# EAGLE design DisplayController (EAGLE 6.1)

## Sheet 1 of 3: Power Supplies
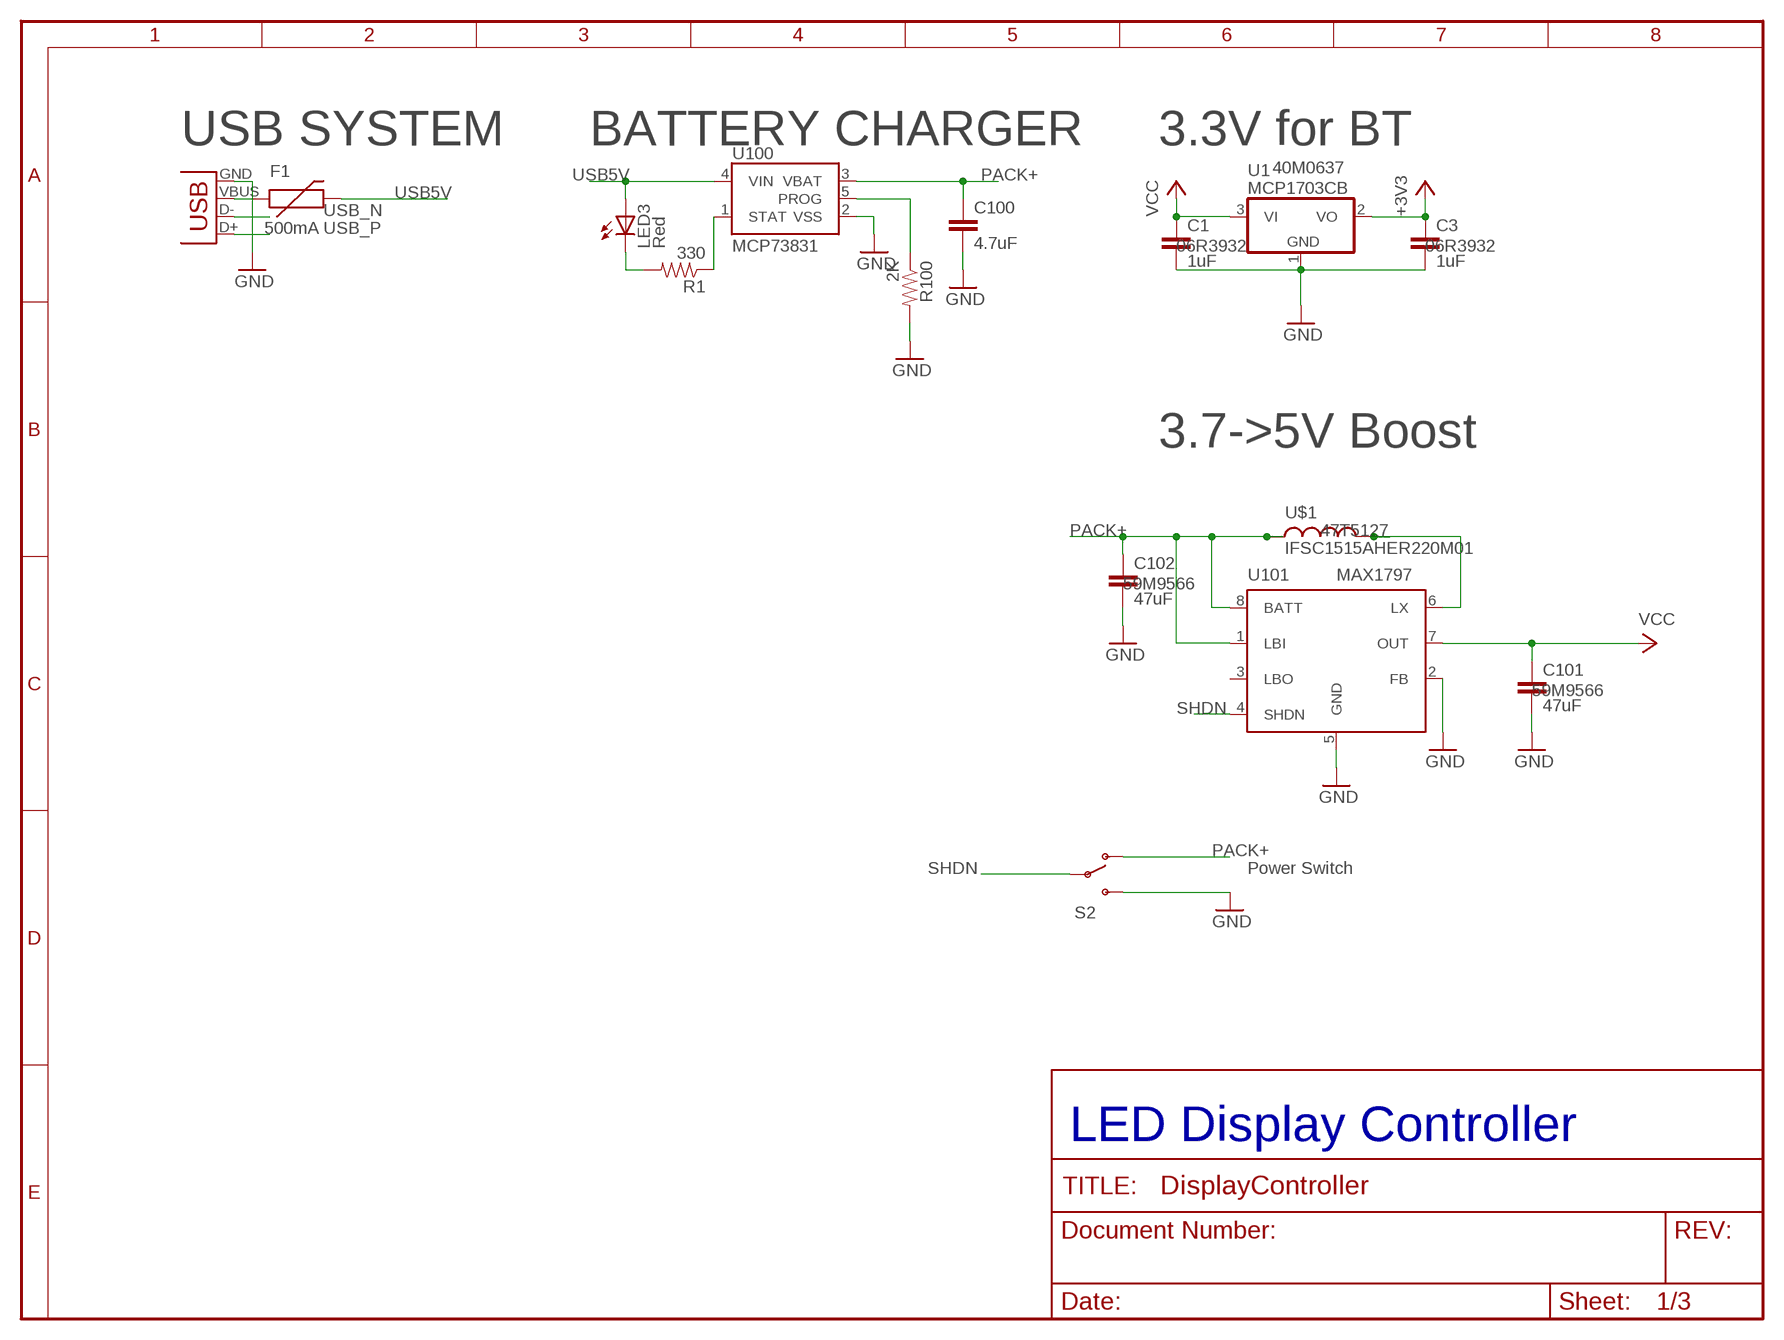
[diagram p0: schematic, sheet 1]

### Parts
C1  1uF  CAP0805  [0805]
C3  1uF  CAP0805  [0805]
C100  4.7uF  CAP0603-CAP  [0603-CAP]
C101  47uF  CAP1206  [1206]
C102  47uF  CAP1206  [1206]
F1  500mA  PTCSMD  [PTC-1206]
J1  USB0001LF  [10104110-0001LF]
LED3  Red  LED0603  [LED-0603]
R1  330  RESISTOR0603-RES  [0603-RES]
R100  2K  RESISTOR0805-RES  [0805]
S2  SWITCH-SPDT-SMD-A  [SWITCH-SPST-SMD-A]
U1  MCP1703CB  [SOT23]
U100  MCP73831  [SOT23-5]
U101  MAX1797  [UMAX8]
U$1  IFSC1515AHER220M01  [IFSC]

### Nets
+3V3: C3.1 U1.2(VO) ; also sheet 2
GND: C1.2 C3.2 C100.2 C101.2 C102.2 J1.GND R100.2 S2.3(S) U1.1(GND) U100.2(VSS) U101.2(FB) U101.5(GND) ; also sheet 2,3
N$2 [3v3 current]: F1.1 J1.VBUS
N$5: R1.1 U100.1(STAT)
N$7: LED3.C R1.2
N$21: R100.1 U100.5(PROG)
N$24 [5V]: U101.6(LX) U$1.2
PACK+: C100.1 C102.1 S2.1(O) U100.3(VBAT) U101.1(LBI) U101.8(BATT) U$1.1 ; also sheet 2,3
SHDN [3v3 current]: S2.2(P) U101.4(SHDN)
USB5V: F1.2 LED3.A U100.4(VIN) ; also sheet 2
USB_N: J1.D- ; also sheet 2
USB_P: J1.D+ ; also sheet 2
VCC: C1.1 C101.1 U1.3(VI) U101.7(OUT) ; also sheet 2,3
Unconnected: U101.3(LBO)

### Notes on the sheet
- USB SYSTEM | BATTERY CHARGER | 3.3V for BT
- 3.7->5V Boost
- Power Switch
- LED Display Controller

## Sheet 2 of 3: Interfaces and Connectors
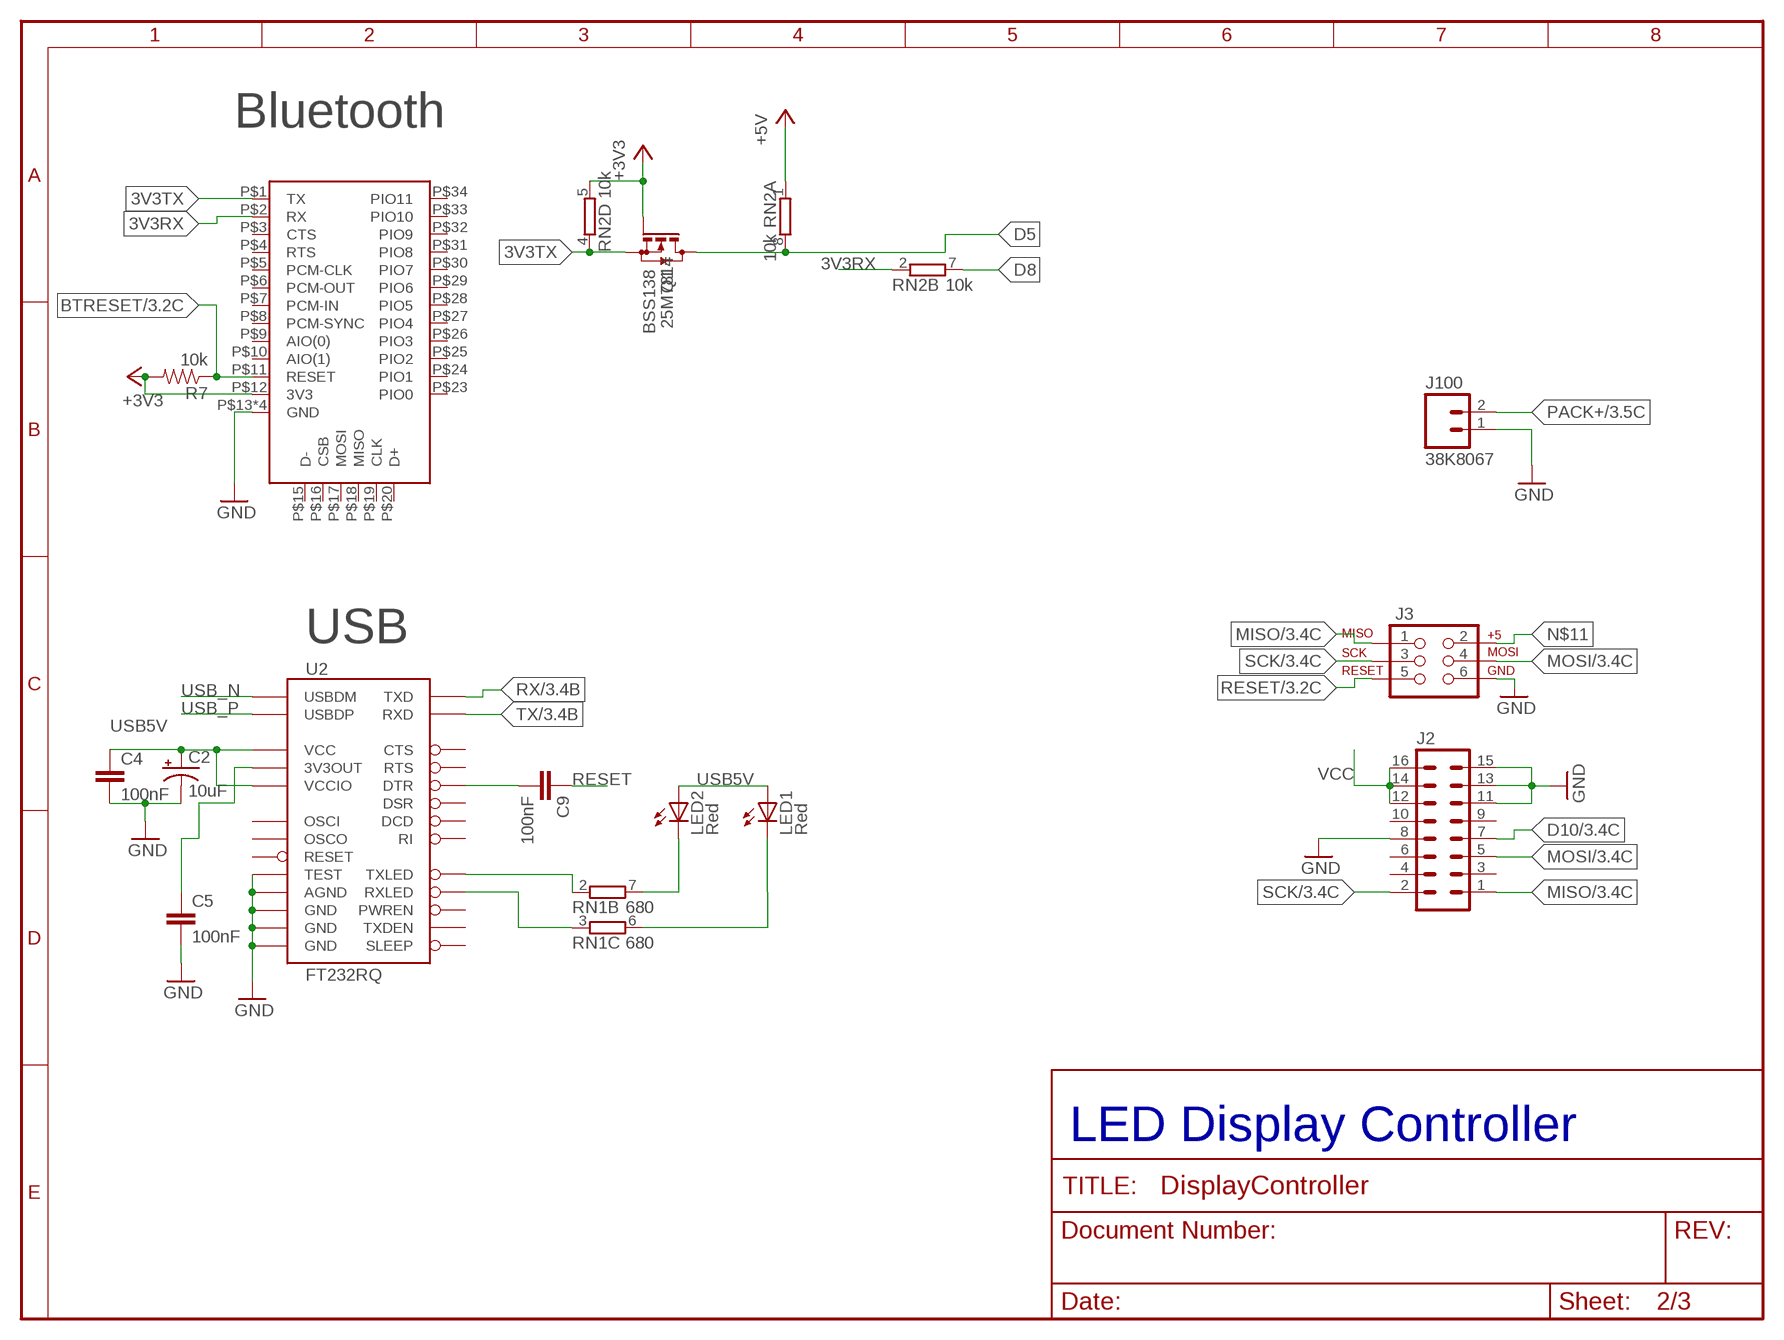
[diagram p1: schematic, sheet 2]

### Parts
C2  10uF  CAP_POL1206  [EIA3216]
C4  100nF  CAP0603-CAP  [0603-CAP]
C5  100nF  CAP0603-CAP  [0603-CAP]
C9  100nF  CAP0603-CAP  [0603-CAP]
J2  MA08-2  [MA08-2]
J3  AVR_SPI_PRG_62X3_LOCK  [2X3_LOCK]
J100  38K8067  M02-JST-2MM-SMT  [JST-2-SMD]
LED1  Red  LED0603  [LED-0603]
LED2  Red  LED0603  [LED-0603]
Q1  BSS138  BSS123  [SOT23]
R7  10k  RESISTOR0603-RES  [0603-RES]
RN1  680  4R-NEXB38V  [EXB38V]
RN2  10k  4R-NEXB38V  [EXB38V]
U2  FT232RQ  [QFN-32]
U$2  DX_BT_MODULE  [DXBLUETOOTHMODULE]

### Nets
3V3RX: RN2.2 U$2.P$2(RX)
3V3TX: Q1.2(S) RN2.4 U$2.P$1(TX)
+3V3: Q1.1(G) R7.2 RN2.5 U$2.P$12(3V3) ; also sheet 1
BTRESET: R7.1 U$2.P$11(RESET) ; also sheet 3
D5: Q1.3(D) RN2.8 ; also sheet 3
D8: RN2.7 ; also sheet 3
D10: J2.7 ; also sheet 3
GND: C2.C(-) C4.2 C5.2 J2.8 J2.11 J2.13 J2.15 J3.6 J100.1 U2.4(GND) U2.17(GND) U2.20(GND) U2.24(AGND) U2.26(TEST) U$2.P$13(GND) U$2.P$14(GND) U$2.P$21(GND) U$2.P$22(GND) ; also sheet 1,3
MISO: J2.1 J3.1 ; also sheet 3
MOSI: J2.5 J3.4 ; also sheet 3
N$3: RN1.2 U2.22(TXLED)
N$4: RN1.3 U2.21(RXLED)
N$6: LED1.C RN1.6
N$10: LED2.C RN1.7
N$11: J3.2
N$12: C9.2 U2.31(DTR)
N$16: C5.1 U2.16(3V3OUT)
PACK+: J100.2 ; also sheet 1,3
RESET: C9.1 J3.5 ; also sheet 3
RX: U2.30(TXD) ; also sheet 3
SCK: J2.2 J3.3 ; also sheet 3
TX: U2.2(RXD) ; also sheet 3
USB5V: C2.A(+) C4.1 LED1.A LED2.A U2.1(VCCIO) U2.19(VCC) ; also sheet 1
USB_N: U2.15(USBDM) ; also sheet 1
USB_P: U2.14(USBDP) ; also sheet 1
VCC: J2.12 J2.14 J2.16 RN2.1 ; supply symbol labelled +5V ; also sheet 1,3
Unconnected: J2.3 J2.4 J2.6 J2.9 J2.10 RN1.1 RN1.4 RN1.5 RN1.8 RN2.3 RN2.6 U2.3(RI) U2.6(DSR) U2.7(DCD) U2.8(CTS) U2.9(SLEEP) U2.10(TXDEN) U2.11(PWREN) U2.18(RESET) U2.27(OSCI) U2.28(OSCO) U2.32(RTS) U$2.P$3(CTS) U$2.P$4(RTS) U$2.P$5(PCM-CLK) U$2.P$6(PCM-OUT) U$2.P$7(PCM-IN) U$2.P$8(PCM-SYNC) U$2.P$9(AIO(0)) U$2.P$10(AIO(1)) U$2.P$15(D-) U$2.P$16(CSB) U$2.P$17(MOSI) U$2.P$18(MISO) U$2.P$19(CLK) U$2.P$20(D+) U$2.P$23(PIO0) U$2.P$24(PIO1) U$2.P$25(PIO2) U$2.P$26(PIO3) U$2.P$27(PIO4) U$2.P$28(PIO5) U$2.P$29(PIO6) U$2.P$30(PIO7) U$2.P$31(PIO8) U$2.P$32(PIO9) U$2.P$33(PIO10) U$2.P$34(PIO11)

### Notes on the sheet
- Bluetooth
- USB
- LED Display Controller

## Sheet 3 of 3: Microcontroller
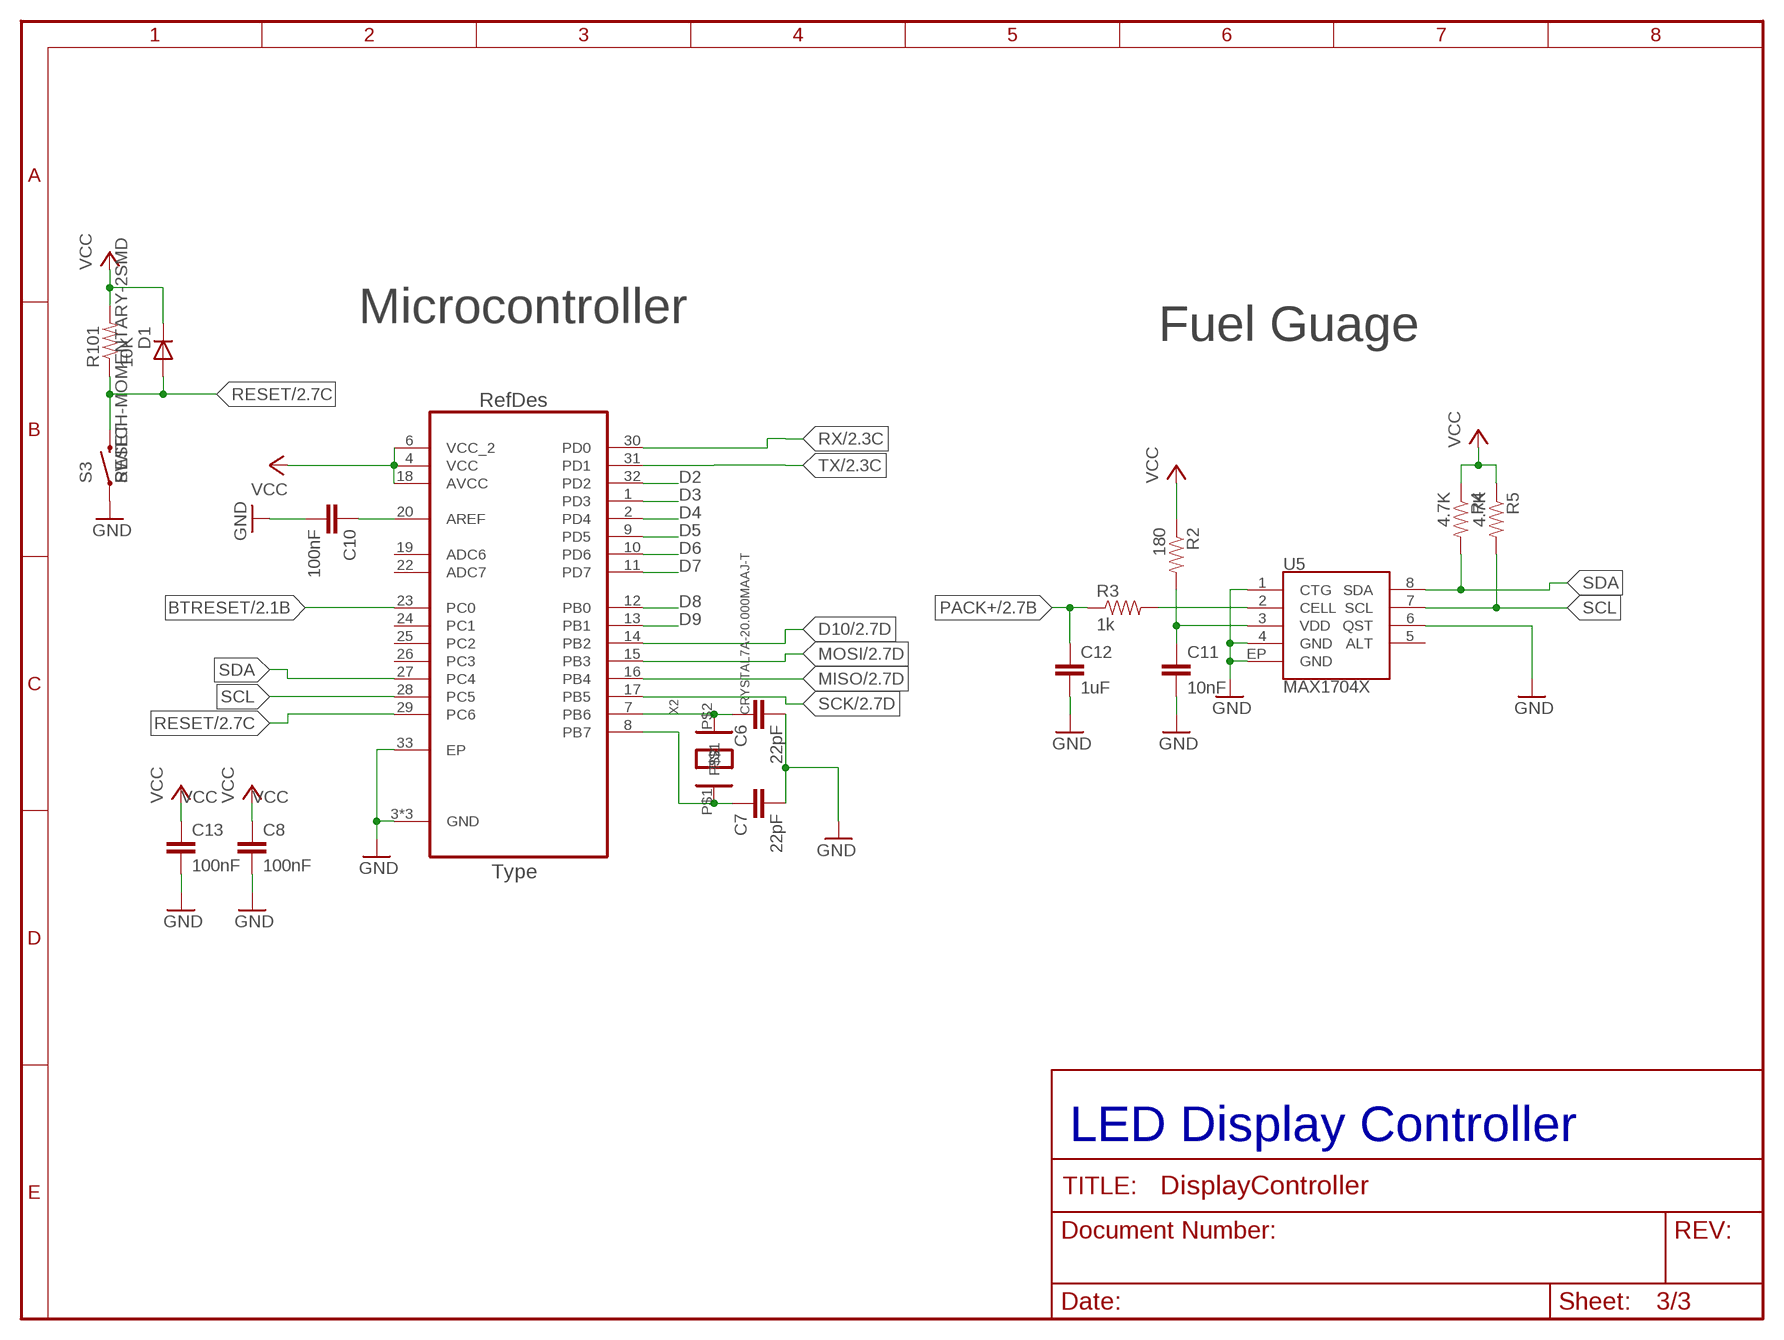
[diagram p2: schematic, sheet 3]

### Parts
C6  22pF  CAP0603-CAP  [0603-CAP]
C7  22pF  CAP0603-CAP  [0603-CAP]
C8  100nF  CAP0603-CAP  [0603-CAP]
C10  100nF  CAP0805  [0805]
C11  10nF  CAP0603-CAP  [0603-CAP]
C12  1uF  CAP0603-CAP  [0603-CAP]
C13  100nF  CAP0603-CAP  [0603-CAP]
D1  LEDSML1206  [SML1206]
R2  180  RESISTOR0603-RES  [0603-RES]
R3  1k  RESISTOR0603-RES  [0603-RES]
R4  4.7K  RESISTOR0603-RES  [0603-RES]
R5  4.7K  RESISTOR0603-RES  [0603-RES]
R101  10K  RESISTOR0805-RES  [0805]
S3  SWITCH-MOMENTARY-2SMD  [TACTILE_SWITCH_SMD]
U3  ATMEGA328P-MU  [QFN50P500X500X100-33N]
U5  MAX1704X  [TDFN-8]
X2  CRYSTAL7A-20.000MAAJ-T  [7A]

### Nets
BTRESET: U3.23(PC0) ; also sheet 2
D2: U3.32(PD2)
D3: U3.1(PD3)
D4: U3.2(PD4)
D5: U3.9(PD5) ; also sheet 2
D6: U3.10(PD6)
D7: U3.11(PD7)
D8: U3.12(PB0) ; also sheet 2
D9: U3.13(PB1)
D10: U3.14(PB2) ; also sheet 2
GND: C6.2 C7.2 C8.2 C10.2 C11.2 C12.2 C13.2 S3.1 U3.3(GND) U3.5(GND) U3.21(GND) U3.33(EP) U5.1(CTG) U5.4(GND) U5.6(QST) U5.EP(GND) ; also sheet 1,2
MISO: U3.16(PB4) ; also sheet 2
MOSI: U3.15(PB3) ; also sheet 2
N$1: C10.1 U3.20(AREF)
N$8: C6.1 U3.7(PB6) X2.P$2
N$9: C7.1 U3.8(PB7) X2.P$1
N$14: C11.1 R2.2 U5.3(VDD)
N$17: R3.2 U5.2(CELL)
PACK+: C12.1 R3.1 ; also sheet 1,2
RESET: D1.A R101.1 S3.3 U3.29(PC6) ; also sheet 2
RX: U3.30(PD0) ; also sheet 2
SCK: U3.17(PB5) ; also sheet 2
SCL: R5.2 U3.28(PC5) U5.7(SCL)
SDA: R4.2 U3.27(PC4) U5.8(SDA)
TX: U3.31(PD1) ; also sheet 2
VCC: C8.1 C13.1 D1.C R2.1 R4.1 R5.1 R101.2 U3.4(VCC) U3.6(VCC_2) U3.18(AVCC) ; also sheet 1,2
Unconnected: U3.19(ADC6) U3.22(ADC7) U3.24(PC1) U3.25(PC2) U3.26(PC3) U5.5(ALT)

### Notes on the sheet
- Microcontroller
- Fuel Guage
- RESET
- LED Display Controller

## Library data of the parts
C1 C3 = SparkFun:CAP: Capacitor Standard 0603 ceramic capacitor, and 0.1" leaded capacitor.; NEWARKPN: 06R3932
C2 = SparkFun:CAP_POL: Capacitor Polarized These are standard SMD and PTH capacitors. Normally 10uF, 47uF, and 100uF in electrolytic and tantalum varieties. Always verify the external diameter of the through hole cap, it varies with capacity, voltage, and manufacturer. The EIA devices should be standard.
C4-C13 = SparkFun:CAP: Capacitor Standard 0603 ceramic capacitor, and 0.1" leaded capacitor.
C100 = SparkFun:CAP: Capacitor Standard 0603 ceramic capacitor, and 0.1" leaded capacitor.; NEWARK_PN: 48T2909
C101 C102 = SparkFun:CAP: Capacitor Standard 0603 ceramic capacitor, and 0.1" leaded capacitor.; NEWARK_PN: 59M9566
D1 = MyParts:LED: LED OSRAM: - CHIPLED LG R971, LG N971, LY N971, LG Q971, LY Q971, LO R971, LY R971 LH N974, LH R974 LS Q976, LO Q976, LY Q976 LO Q996 - Hyper CHIPLED LW Q18S LB Q993, LB Q99A, LB R99A - SideLED LS A670, LO A670, LY A670, LG A670, LP A670 LB A673, LV A673, LT A673, LW A673 LH A674 LY A675 LS A676, LA A676, LO A676, LY A676, LW A676 LS A679, LY A679, LG A679 - Hyper Micro SIDELED® LS Y876, LA Y876, LO Y876, LY Y876 LT Y87S - SmartLED LW L88C, LW L88S LB L89C, LB L89S, LG L890 LS L89K, LO L89K, LY L89K LS L896, LA L896, LO L896, LY L896 - TOPLED LS T670, LO T670, LY T670, LG T670, LP T670 LSG T670, LSP T670, LSY T670, LOP T670, LYG T670 LG T671, LOG T671, LSG T671 LB T673, LV T673, LT T673, LW T673 LH T674 LS T676, LA T676, LO T676, LY T676, LB T676, LH T676, LSB T676, LW T676 LB T67C, LV T67C, LT T67C, LS T67K, LO T67K, LY T67K, LW E67C LS E67B, LA E67B, LO E67B, LY E67B, LB E67C, LV E67C, LT E67C LW T67C LS T679, LY T679, LG T679 LS T770, LO T770, LY T770, LG T770, LP T770 LB T773, LV T773, LT T773, LW T773 LH T774 LS E675, LA E675, LY E675, LS T675 LS T776, LA T776, LO T776, LY T776, LB T776 LHGB T686 LT T68C, LB T68C - Hyper Mini TOPLED® LB M676 - Mini TOPLED Santana® LG M470 LS M47K, LO M47K, LY M47K Source: http://www.osram.convergy.de LUXEON: - LUMILED® LXK2-PW12-R00, LXK2-PW12-S00, LXK2-PW14-U00, LXK2-PW14-V00 LXK2-PM12-R00, LXK2-PM12-S00, LXK2-PM14-U00 LXK2-PE12-Q00, LXK2-PE12-R00, LXK2-PE12-S00, LXK2-PE14-T00, LXK2-PE14-U00 LXK2-PB12-K00, LXK2-PB12-L00, LXK2-PB12-M00, LXK2-PB14-N00, LXK2-PB14-P00, LXK2-PB14-Q00 LXK2-PR12-L00, LXK2-PR12-M00, LXK2-PR14-Q00, LXK2-PR14-R00 LXK2-PD12-Q00, LXK2-PD12-R00, LXK2-PD12-S00 LXK2-PH12-R00, LXK2-PH12-S00 LXK2-PL12-P00, LXK2-PL12-Q00, LXK2-PL12-R00 Source: www.luxeon.com KINGBRIGHT: KA-3528ASYC Source: www.kingbright.com; NEWARK_PN: 09J8040
F1 = SparkFun:PTC: Resettable Fuse PTC Resettable Fuse. Spark Fun Electronics SKU : COM-08357
J1 = MyParts:USB: USB Connectors USB-B-PTH is fully proven SKU : PRT-00139 USB-miniB is fully proven SKU : PRT-00587 USB-A-PCB is untested. USB-A-H is throughly reviewed, but untested. Spark Fun Electronics SKU : PRT-00437 USB-B-SMT is throughly reviewed, but untested. Needs silkscreen touching up. USB-A-S has not been used/tested USB-MB-H has not been used/tested; NEWARK_PN: 82R7424
J2 = con-lstb:MA08-2: PIN HEADER; OC_FARNELL: unknown; OC_NEWARK: 08N6809
J3 = SparkFun:AVR_SPI_PRG_6: AVR ISP 6 Pin This is the reduced ISP connector for AVR programming. Common on Arduino. This footprint will take up less PCB space and can be used with a 10-pin to 6-pin adapter such as SKU: BOB-08508
J100 = SparkFun:M02: Header 2 Standard 2-pin 0.1" header. Use with straight break away headers (SKU : PRT-00116), right angle break away headers (PRT-00553), swiss pins (PRT-00743), machine pins (PRT-00117), and female headers (PRT-00115). Molex polarized connector foot print use with SKU : PRT-08233 with associated crimp pins and housings.
LED1-LED3 = SparkFun:LED: LEDs Standard schematic elements and footprints for 5mm, 3mm, 1206, and 0603 sized LEDs. 5mm - Spark Fun Electronics SKU : COM-00529 (and others)
Q1 = transistor-small-signal:BSS123: N-CHANNEL MOS FET; NEWARKPN: 25M7814
R1-R5 R7 R100 R101 = SparkFun:RESISTOR: Resistor Basic schematic elements and footprints for 0603, 1206, and PTH resistors.
RN1 = resistor-dil:4R-N: Array Chip Resistor Source: RS Component / Phycomp; OC_FARNELL: unknown; OC_NEWARK: unknown
RN2 = resistor-dil:4R-N: Array Chip Resistor Source: RS Component / Phycomp; OC_FARNELL: unknown; OC_NEWARK: 15M6872
S2 = SparkFun-Electromechanical:SWITCH-SPDT: SPST Switch Simple slide switch. Spark Fun Electronics SKU : COM-00102
S3 = SparkFun:SWITCH-MOMENTARY-2
U1 = linear:MCP1703: 250 mA, 16V, Low Quiescent Current LDO Regulator Source: http://ww1.microchip.com/downloads/en/DeviceDoc/22049b.pdf; NEWARKPN: 40M0637
U2 = SparkFun:FT232RQ: Non-stock item, unproven FP for this part.
U3 = MyParts:ATMEGA328P-MU; DESCRIPTION: Programmable Flash; MPN: ATMEGA328P-MU; OC_FARNELL: 1748522; OC_NEWARK: 26R2526; PACKAGE: QFN-32; SUPPLIER: Atmel
U5 = SparkFun:MAX1704X: MAX17043/MAX17044: Battery Fuel Guage (43 is 1cell, 44 is 2cell)
U100 = SparkFun:MCP73831: Microchip's MCP73831 Miniature single cell, fully integrated Li-Ion, Li-polymer charge management controller http://ww1.microchip.com/downloads/en/DeviceDoc/21984a.pdf; NEWARK_PN: 56K7045
U101 = MyParts:MAX1797: DC/DC CONVERTER; MF: MAXIM; MPN: MAX1674EUA+; OC_FARNELL: 1379864; OC_NEWARK: 23K5719
U$1 = MyParts:IFSC; NEWARK_PN: 47T5127
U$2 = MyParts:DX_BT_MODULE: http://www.dealextreme.com/p/wireless-bluetooth-rs232-ttl-transceiver-module-80711
X2 = MyParts:CRYSTAL

## Net classes
0 default: width 0.254 mm, drill 0.33 mm, clearance 0.203 mm
1 3v3 current: width 0.305 mm, drill 0.33 mm, clearance 0.254 mm
3 5V: width 0.406 mm, drill 0.33 mm, clearance 0.254 mm

## Board
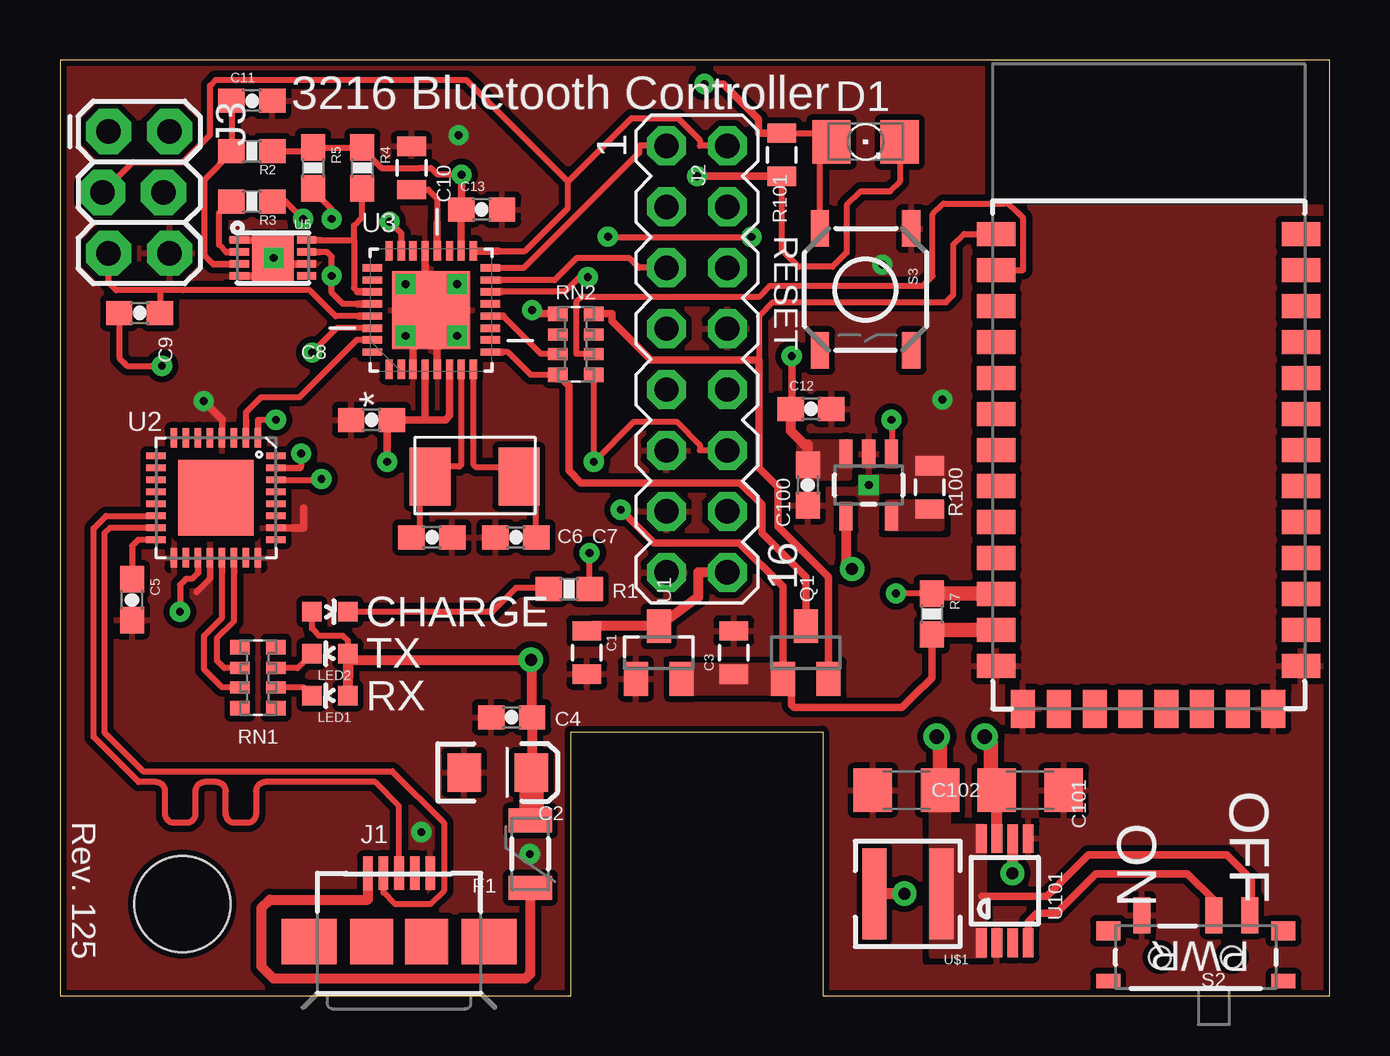
[diagram p3: board, top side]
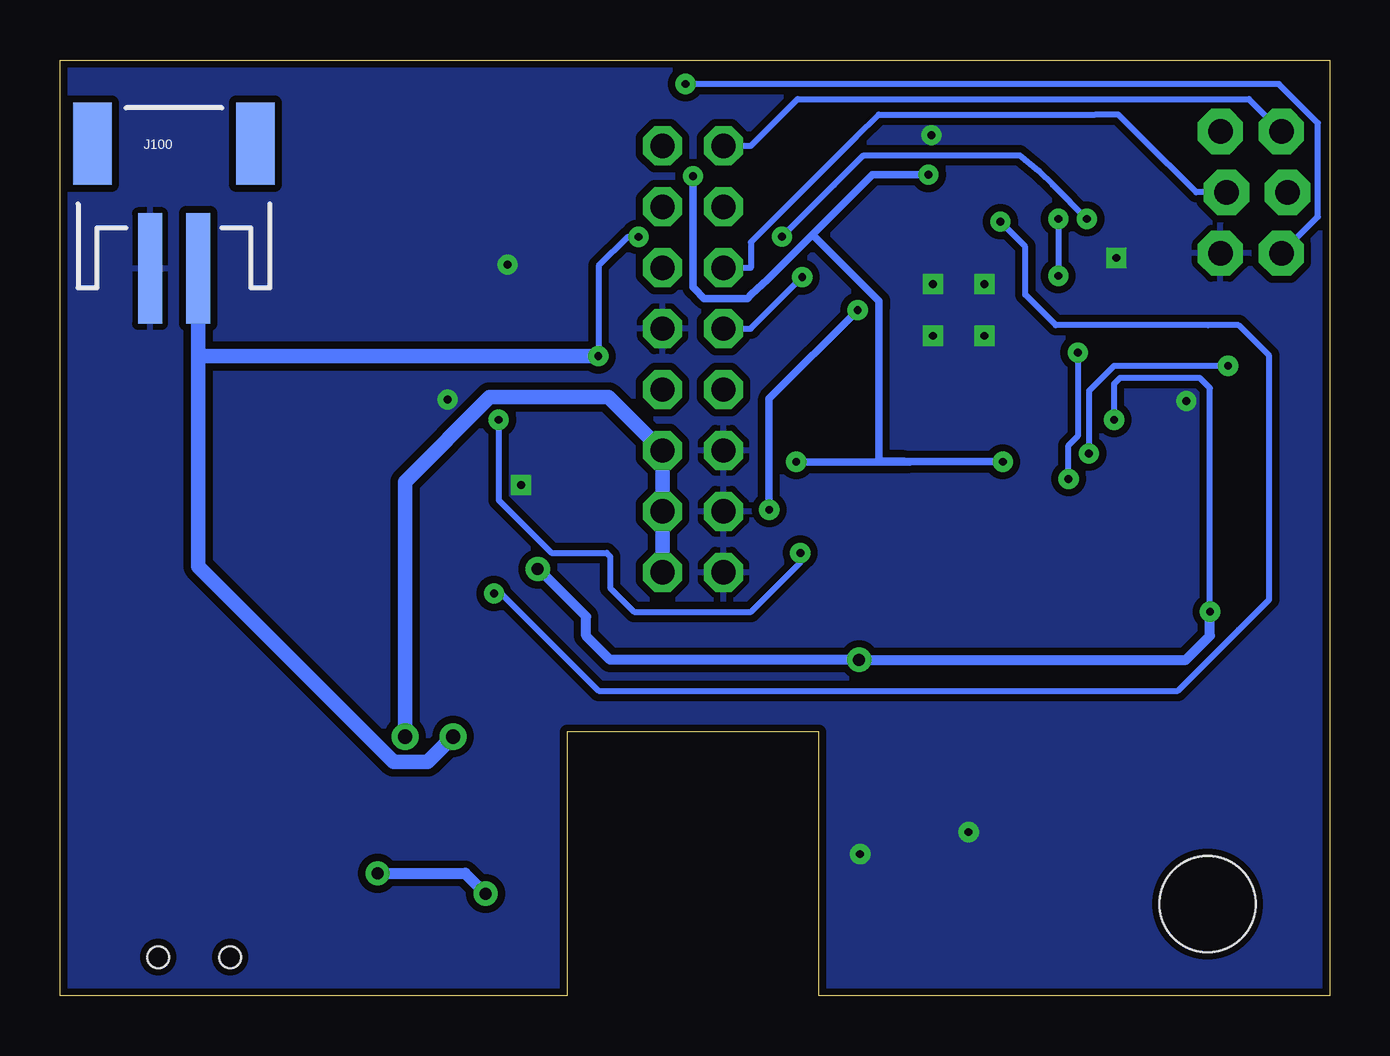
[diagram p4: board, bottom side, seen from below]

Size 52.94 x 39 mm. Coordinates in mm from the lower left corner, seen from the top.
Outline: 21.3,0 0,0 0,39 52.94,39 52.94,11 52.94,0 31.8,0 31.8,11 21.3,11 21.3,0
Copper layers (1*16): Top 0.035mm / dielectric 1.5mm / Bottom 0.035mm
Design rules: minimum track width 8mil, minimum drill 13mil, track to track 8mil, track to pad 5mil, pad to pad 5mil, via to via 8mil, smd to smd 5mil, copper to edge 10mil, drill to drill 8mil, minimum pad ring 12mil, minimum via ring 10mil, stop-mask expansion 4mil, vias tented up to drill 25mil, thermal gap 10mil
Holes 4 mm at 5.1,3.81
tRestrict: area 38.8,33.2 to 52.9,39

### Footprints (pad centres in the part's own frame; a part is rotated, then mirrored left to right if it is on the bottom)
0805 = smd 0.8 x 1.2: 1 -0.9,0; 2 0.9,0
EIA3216 = smd 1.4 x 1.6: A 1.4,0; C -1.4,0
0603-CAP = smd 1.1 x 1: 1 -0.85,0; 2 0.85,0
1206 = smd 1.6 x 1.8: 1 -1.4,0; 2 1.4,0
1206' = smd 1.6 x 1.803: A -1.422,0; C 1.422,0
PTC-1206 = smd 1 x 1.8: 1 -1.4,0; 2 1.4,0
10104110-0001LF = smd 0.4 x 1.4: D+ 0,2.85; D- -0.65,2.85; GND 1.3,2.85; ID 0.65,2.85; VBUS -1.3,2.85 | smd 2.3 x 1.9: MT1 -3.75,0; MT2 3.75,0 | smd 1.8 x 1.9: P$1 -1.15,0; P$2 1.15,0
MA08-2 = drill 1.016 octagon: 1 -8.89,-1.27; 2 -8.89,1.27; 3 -6.35,-1.27; 4 -6.35,1.27; 5 -3.81,-1.27; 6 -3.81,1.27; 7 -1.27,-1.27; 8 -1.27,1.27; 9 1.27,-1.27; 10 1.27,1.27; 11 3.81,-1.27; 12 3.81,1.27; 13 6.35,-1.27; 14 6.35,1.27; 15 8.89,-1.27; 16 8.89,1.27
2X3_LOCK = drill 1.016 pad 1.88 octagon: 1 0,0; 2 0,2.54; 3 2.54,-0.254; 4 2.54,2.286; 5 5.08,0; 6 5.08,2.54
JST-2-SMD = smd 1 x 4.6: 1 -1,-3.7; 2 1,-3.7 | smd 1.6 x 3.4: NC1 -3.4,1.5; NC2 3.4,1.5
LED-0603 = smd 0.8 x 0.8: A 0,-0.75; C 0,0.75
SOT23 = smd 1 x 1.4: 1 -0.95,-1.1; 2 0.95,-1.1; 3 0,1.1
0603-RES = smd 1.1 x 1: 1 -0.85,0; 2 0.85,0
EXB38V = smd 0.6 x 0.8: 1 -1.275,-0.75; 4 1.275,-0.75; 5 1.275,0.75; 8 -1.275,0.75 | smd 0.5 x 0.8: 2 -0.4,-0.75; 3 0.4,-0.75; 6 0.4,0.75; 7 -0.4,0.75
SWITCH-SPST-SMD-A = smd 0.7 x 1.5: 1 -2.25,-1.75; 2 -0.75,-1.75; 3 2.25,-1.75 | smd 1 x 0.6: GND1 -3.65,1; GND3 3.65,1 | smd 1 x 0.8: GND2 -3.65,-1.1; GND4 3.65,-1.1 | hole 0.9: -1.5,0; 1.5,0
TACTILE_SWITCH_SMD = smd 1.524 x 0.762: 1 -2.54,1.905; 2 2.54,1.905; 3 -2.54,-1.905; 4 2.54,-1.905
QFN-32 = smd 0.285 x 0.8: 1 -1.75,-2.5; 2 -1.25,-2.5; 3 -0.75,-2.5; 4 -0.25,-2.5; 5 0.25,-2.5; 6 0.75,-2.5; 7 1.25,-2.5; 8 1.75,-2.5; 17 1.75,2.5; 18 1.25,2.5; 19 0.75,2.5; 20 0.25,2.5; 21 -0.25,2.5; 22 -0.75,2.5; 23 -1.25,2.5; 24 -1.75,2.5 | smd 0.8 x 0.285: 9 2.5,-1.75; 10 2.5,-1.25; 11 2.5,-0.75; 12 2.5,-0.25; 13 2.5,0.25; 14 2.5,0.75; 15 2.5,1.25; 16 2.5,1.75; 25 -2.5,1.75; 26 -2.5,1.25; 27 -2.5,0.75; 28 -2.5,0.25; 29 -2.5,-0.25; 30 -2.5,-0.75; 31 -2.5,-1.25; 32 -2.5,-1.75 | smd 3.15 x 3.15: EP 0,0
QFN50P500X500X100-33N = smd 0.813 x 0.305: 1 -2.464,1.753; 2 -2.464,1.245; 3 -2.464,0.762; 4 -2.464,0.254; 5 -2.464,-0.254; 6 -2.464,-0.762; 7 -2.464,-1.245; 8 -2.464,-1.753; 17 2.464,-1.753; 18 2.464,-1.245; 19 2.464,-0.762; 20 2.464,-0.254; 21 2.464,0.254; 22 2.464,0.762; 23 2.464,1.245; 24 2.464,1.753 | smd 0.305 x 0.813: 9 -1.753,-2.464; 10 -1.245,-2.464; 11 -0.762,-2.464; 12 -0.254,-2.464; 13 0.254,-2.464; 14 0.762,-2.464; 15 1.245,-2.464; 16 1.753,-2.464; 25 1.753,2.464; 26 1.245,2.464; 27 0.762,2.464; 28 0.254,2.464; 29 -0.254,2.464; 30 -0.762,2.464; 31 -1.245,2.464; 32 -1.753,2.464 | smd 3.251 x 3.251: 33 0,0
TDFN-8 = smd 0.8 x 0.3: 1 -1.4,0.75; 2 -1.4,0.25; 3 -1.4,-0.25; 4 -1.4,-0.75; 5 1.4,-0.75; 6 1.4,-0.25; 7 1.4,0.25; 8 1.4,0.75 | smd 1.73 x 1.88: EP 0,0
SOT23-5 = smd 0.55 x 1.2: 1 -0.95,-1.3; 2 0,-1.3; 3 0.95,-1.3; 4 0.95,1.3; 5 -0.95,1.3
UMAX8 = smd 0.45 x 1.2: 1 -0.975,-2.175; 2 -0.325,-2.175; 3 0.325,-2.175; 4 0.975,-2.175; 5 0.975,2.175; 6 0.325,2.175; 7 -0.325,2.175; 8 -0.975,2.175
IFSC = smd 1 x 3.8: 1 -1.4,0; 2 1.4,0
DXBLUETOOTHMODULE = smd 1.6 x 1: P$1 -6.35,6.35; P$2 -6.35,4.85; P$3 -6.35,3.35; P$4 -6.35,1.85; P$5 -6.35,0.35; P$6 -6.35,-1.15; P$7 -6.35,-2.65; P$8 -6.35,-4.15; P$9 -6.35,-5.65; P$10 -6.35,-7.15; P$11 -6.35,-8.65; P$12 -6.35,-10.15; P$13 -6.35,-11.66; P$22 6.35,-11.66; P$23 6.35,-10.15; P$24 6.35,-8.65; P$25 6.35,-7.15; P$26 6.35,-5.65; P$27 6.35,-4.15; P$28 6.35,-2.65; P$29 6.35,-1.15; P$30 6.35,0.35; P$31 6.35,1.85; P$32 6.35,3.35; P$33 6.35,4.85; P$34 6.35,6.35 | smd 1 x 1.6: P$14 -5.23,-13.45; P$15 -3.74,-13.45; P$16 -2.25,-13.45; P$17 -0.76,-13.45; P$18 0.73,-13.45; P$19 2.22,-13.45; P$20 3.71,-13.45; P$21 5.2,-13.45
7A = smd 1.7 x 2.4: P$1 1.83,-0.04; P$2 -1.87,-0.04

### Placement (x,y rotation side)
C1  21.96,14.3 270 top
C2  18.25,9.3 0 top
C3  28.09,14.3 90 top
C4  18.82,11.6 180 top
C5  3,16.5 270 top
C6  15.5,19.1 0 top
C7  19,19.1 180 top
C8  12.98,24 180 top
C9  3.32,28.45 180 top
C10  14.65,34.5 90 top
C11  8,37.3 0 top
C12  31.3,24.45 0 top
C13  17.58,32.77 0 top
C100  31.17,21.28 270 top
C101  40.44,8.56 0 top
C102  35.28,8.56 180 top
D1  [1206']  33.58,35.59 0 top
F1  19.6,5.9 90 top
J1  14.13,2.25 0 top
J2  26.55,26.53 270 top
J3  2.02,36.02 270 top
J100  48.19,34.01 0 bottom
LED1  11.25,12.5 90 top
LED2  11.25,14.25 90 top
LED3  11.25,16 270 top
Q1  31.09,14.3 0 top
R1  21.23,16.95 180 top
R2  8,35.2 180 top
R3  8,33.1 180 top
R4  12.6,34.5 270 top
R5  10.55,34.5 270 top
R7  36.34,15.9 270 top
R100  36.25,21.18 90 top
R101  30.08,35.05 270 top
RN1  8.25,13.25 270 top
RN2  21.5,27.15 90 top
S2  47.34,1.6 180 top
S3  33.58,29.43 270 top
U1  24.96,14.3 0 top
U2  6.5,20.75 180 top
U3  15.47,28.57 90 top
U5  8.88,30.75 0 top
U100  33.71,21.28 180 top
U101  39.38,4.37 0 top
U$1  35.34,4.24 180 top
U$2  45.38,25.4 0 top
X2  17.3,21.68 0 top

### Tracks (layer width: path | path; a pad name or v marks a point on that pad's centre or on a via)
3V3RX
  Top 0.254: RN2.2 21.52,26.75 21.52,28.92 21.73,29.12 29.12,29.12 29.59,29.59 31.17,29.59 35.59,29.59 35.97,29.59 36.37,30 36.37,32.56 36.83,33.02 39.37,33.02 39.54,33.02 39.92,32.64 40.16,32.4 40.16,30.25 U$2.P$2
3V3TX
  Top 0.254: 29.12,26.5 29.12,28.31 29.72,28.91 36.93,28.91 37.24,29.21 37.24,31.29 37.69,31.75 U$2.P$1
  Top 0.305: 39.06,31.69 39.02,31.69 U$2.P$1 | RN2.4 23.01,28.43 23.01,28.11 24.61,26.51 24.62,26.5 29.12,26.5 29.12,22 29.92,21.2 29.92,19.56 32.03,17.44 Q1.2
+3V3  (via drill 0.33 pad 0.84)
  Top 0.305: v23.38,20.25 24.75,18.88 28.31,18.88 30.14,17.05 Q1.1 30.48,12.85 30.48,12.12 30.59,12.01 35.1,12.01 35.55,12.46 36.34,13.25 R7.2 36.54,15.25 | RN2.5 19.84,28.43 v19.68,28.57
  Top 0.61: 36.54,15.25 U$2.P$12
  Bottom 0.305: v23.38,20.25 23.38,24.89 v19.68,28.57
  pour Top (no thermals): 25.54,13.77 30.51,13.77 30.51,12.62 25.59,12.62
BTRESET  (via drill 0.33)
  Top 0.254: R7.1 v34.85,16.75 v34.85,16.76 | U3.23 14.23,31.77 v13.74,32.26
  Top 0.305: U$2.P$11
  Top 0.61: R7.1 U$2.P$11
  Bottom 0.254: v34.85,16.76 34.54,16.76 30.48,12.7 6.35,12.7 3.81,15.24 2.54,16.51 2.54,26.67 3.81,27.94 5.08,27.94 11.43,27.94 12.7,29.21 12.7,31.22 v13.74,32.26
D5
  Top 0.254: RN2.8 19.62,25.88 18.68,26.82 18.43,26.82
  Top 0.305: Q1.3 31.09,17.45 29.26,19.28 29.26,20.46 28.35,21.38 22,21.38 21.73,21.38 21.21,21.89 21.21,25.42 RN2.8 | U3.9 18.43,26.82
D8
  Top 0.254: RN2.7 20.05,26.75 18.48,28.32
  Top 0.305: 18.48,28.32 U3.12
D10  (via drill 0.33 pad 0.84)
  Top 0.254: v22,29.95 21.66,29.95 21.04,29.34 18.41,29.34
  Top 0.305: 18.41,29.34 U3.14
  Bottom 0.254: J2.7 24.14,27.8 24.14,27.82 v22,29.95
GND  (via drill 0.33 pad 0.84)
  Top 0.254: 6.25,17.38 5.69,16.82
  Top 0.279: U2.4 6.75,24.01 | U2.20 6.25,17.38
  Top 0.305: v14.4,29.65 15.22,29.65 U3.21 | U3.5 15.73,27.5 | 15.73,27.5 v16.55,27.5 | U3.33 15.73,27.5 | U5.6 8.9,30.5 v8.9,30.75 | U5.1 8.89,31.5 8.89,30.48 8.41,30 U5.4 | U2.26 10.16,19.5 10.16,20.32 | 6.75,24.01 v5.98,24.78 | U3.3 14.71,27.19 v14.4,27.5
  other vias: 34.29,30.47 16.55,29.65 33.71,21.28 16.61,35.86 15.06,6.81 36.78,24.84 19.58,5.9
  pour Top (no thermals): 35.35,23.55 35.35,21.25 37.23,21.25 37.23,23.55
  pour Bottom (isolate 0.305, rank 2): 0,39 52.94,39.2 52.94,0 31.75,0 31.75,11 21.25,11 21.25,0 0,0
  pour Top (isolate 0.254, rank 2): 0,39 52.94,39 52.94,0 31.75,0 31.75,11 21.25,11 21.25,0 0,0
MISO
  Top 0.254: J2.1 24.14,35.42 24.14,35.13 19.33,30.33 U3.16
  Bottom 0.254: J2.1 24.14,35.42 22.19,37.37 3.38,37.37 J3.1
MOSI
  Top 0.254: J2.5 24.14,30.34 23.74,30.74 21.53,30.74 20.61,29.82 18.37,29.82
  Top 0.305: U3.15 18.37,29.82
  Bottom 0.254: J2.5 24.14,30.34 24.14,31.4 19.74,35.79 18.81,36.73 9.78,36.73 8.83,36.73 7.89,35.79 5.58,33.48 J3.4
N$1
  Top 0.254: C10.1 15.35,33.6 15.73,33.22 15.73,32.22
  Top 0.305: U3.20 15.73,32.22
N$2
  Top 0.406: F1.1 19.6,0.9 19.4,0.7 8.9,0.7 8.4,1.2 8.4,3.65 8.75,4 12.84,4 J1.VBUS
N$3
  Top 0.254: RN1.2 6.85,13.65 6.55,13.95 6.55,14.9 7.25,15.6 7.25,17.6
  Top 0.279: U2.22 7.25,17.6
N$4
  Top 0.254: RN1.3 6.75,12.85 6,13.6 6,15 6.75,15.75 6.75,17.65
  Top 0.279: U2.21 6.75,17.65
N$5  (via drill 0.33 pad 0.84)
  Top 0.254: 22,17 22.02,17 R1.1 22.07,17.02 22.08,17.02 | U100.1 34.66,22.61 34.7,22.65 34.7,23.95 v34.65,24 | 21.97,16.92 22.08,17.02 | 22.08,17.02 v22.08,18.46
  Top 0.305: 21.97,16.92 | 22,17 22.09,17
  Bottom 0.254: v34.65,24 34.65,20.65 32.45,18.45 30.15,18.45 30,18.3 30,17 29,16 24.13,16 22.08,18.05 v22.08,18.46
N$6
  Top 0.254: LED1.C 10.15,12.85 RN1.6
N$7
  Top 0.254: R1.2 20.05,16.95 20,17 19,17 18,16 LED3.C
N$8
  Top 0.254: C6.1 15,19.45 15,21.1 | U3.7 16.72,23.93 16.72,22.93 16.72,22.13 16.64,22.05 15.84,22.05 X2.P$2 15.64,21.85 15.75,21.85 15,21.1 | 14.73,20.83 15,21.1
N$9
  Top 0.254: C7.1 19.85,21.64 X2.P$1 | U3.8 17.23,23.54 17.23,22.14 17.35,22.02 18.75,22.02 X2.P$1 | 19.82,20.95 X2.P$1 | X2.P$1
N$10
  Top 0.254: LED2.C 9.9,13.65 RN1.7
N$12  (via drill 0.33 pad 0.84)
  Top 0.254: v10.05,22.6 10.05,22.05 10,22 | C9.2 2.47,26.58 2.7,26.35 2.8,26.25 v4.25,26.25
  Top 0.279: 10,22 U2.31
  Bottom 0.254: v4.25,26.25 9,26.25 10.05,25.2 v10.05,22.6
N$14
  Top 0.254: 6.38,30.5 6,30.88 6,34 7.15,35.15 R2.2 C11.1
  Top 0.279: U5.3 6.38,30.5
N$16
  Top 0.254: U2.16 3.25,19 3,18.75 C5.1
N$17
  Top 0.254: 6.92,31 6.62,31.3 6.62,32.62 7,33 7.05,33 R3.2
  Top 0.279: U5.2 6.92,31
N$21
  pour Top (no thermals): 36.75,20.55 34.5,20.55 34.5,19.5 36.75,19.5
N$24  (via drill 0.5 pad 0.84)
  Top 0.406: U$1.2 | v39.7,5.11 v39.7,5.1
  Top 0.46: v35.2,4.25 U$1.2 | U101.6 v39.7,5.11
  Bottom 0.46: v39.7,5.1 36.05,5.1 v35.2,4.25
PACK+  (via drill 0.33 pad 0.84, 0.6 pad 1.11)
  Top 0.254: v10.14,32.38 9.41,33.1 8.96,33.1 | 8.96,33.1 9,33.06 8.65,33.06 | R3.1 8.96,33.1 | 32.77,23.09 32.77,22.65 | v28.82,31.62 22.84,31.62 v22.84,31.64
  Top 0.305: 49.65,3.41 49.65,3.11 | 49.65,3.41 49.65,4.85 48.63,5.86 45.42,5.86 42.86,5.86 41.3,4.3 41.2,4.2 41.14,4.14 38.43,4.14 | S2.1 49.65,3.41 | v30.5,26.65 30.5,24.5 C12.1
  Top 0.406: C100.1 31.17,22.99 31.01,22.99 30.45,23.54 C12.1
  Top 0.61: C102.1 36.68,10.67 v36.55,10.8
  Bottom 0.254: v10.14,32.38 11.56,33.8 12.13,34.37 12.94,35.03 19.44,35.03 20.1,34.37 20.67,33.8 v22.84,31.64 | 30.48,26.67 30.48,30.42 29.28,31.62 v28.82,31.62
  Bottom 0.305: 30.38,26.77 30.48,26.67 v30.5,26.65
  Bottom 0.61: v36.55,10.8 37.62,9.73 39.04,9.73 47.19,17.88 47.19,26.84 | 47.19,26.84 46.99,26.65 | J100.2 47.19,26.84 | 46.99,26.65 v30.5,26.65 | 47.15,26.65 46.99,26.65
  pour Top (isolate 0.254, no thermals): 32.83,23.05 30.8,23.05 30.8,21.6 32.91,21.6 32.91,23.02
  pour Top (no thermals): 38.5,7.05 38.5,1.65 36.35,1.65 36.35,7.05
  pour Top (no thermals): 36.35,6.55 36.35,8.6 37,8.6 37,6.55
RESET  (via drill 0.33 pad 0.84)
  Top 0.254: 12.48,28.32 11.49,28.32 10.41,29.4 5.12,29.4 | 4.17,28.8 C9.1 4.17,29.4 5.12,29.4 | 5.12,29.4 2.35,29.4 2.06,29.69 2.03,29.72 2.02,29.73 J3.5 | R101.1 31.75,35.95 31.67,35.87 | S3.3 31.67,35.87 | 31.67,35.87 31.67,35.64 31.75,35.56 32.13,35.56 D1.A
  Top 0.305: R101.1 29.12,35.95 29.12,36.53 27.65,38 v26.86,38 | U3.29 12.48,28.32
  Bottom 0.254: J3.5 0.5,32.47 0.5,36.37 2.13,38 v26.86,38
RX  (via drill 0.33)
  Top 0.254: U3.30 11.53,27.81 v10.52,26.8 | U2.30 10.86,21.5 v10.9,21.54
  Bottom 0.254: v10.52,26.8 10.52,23.32 10.9,22.94 v10.9,21.54
SCK
  Top 0.254: 21.18,33.93 23.83,36.58 25.75,36.58 26.68,35.65 26.68,35.42 J2.2 | 18.29,31.04 19.38,31.04 21.18,32.83 21.18,33.93 | J3.3 3.04,34.75 5.11,34.75 6.25,35.89 6.25,37.94 6.48,38.17 16.93,38.17 21.18,33.93
  Top 0.305: 18.29,31.04 U3.17
SCL  (via drill 0.33 pad 0.84)
  Top 0.254: 12.4,28.83 11.8,28.83 11.33,29.3 v11.33,30 11.33,30.8 11.12,31 10.82,31 | 10.55,33.55 11.33,32.77 v11.33,32.38 | 10.55,33.55 10.55,33.42 10.6,33.38 10.57,33.35 | R5.2 10.55,33.55
  Top 0.279: 10.82,31 U5.7
  Top 0.305: 12.4,28.83 U3.28
  Bottom 0.254: v11.33,32.38 v11.33,30
SDA
  Top 0.254: 12.25,31.5 12.25,29.5 12.41,29.34 | 12.25,31.5 12.25,32.1 12.6,32.45 R4.2 | 10.88,31.5 12.25,31.5
  Top 0.279: U5.8 10.88,31.5
  Top 0.305: U3.27 12.41,29.34
SHDN
  Top 0.305: S2.2 48.09,3.98 46.99,5.08 43.18,5.08 41.91,3.81 41.7,3.6 41.53,3.43 41.2,3.43 40.72,3.43 40.36,3.07 40.36,2.34 40.39,2.31 40.35,2.28 U101.4
TX
  Top 0.254: 7.75,24 7.75,24.32 8.38,24.94 9.98,24.94 11.2,26.16 12.37,27.33 U3.31
  Top 0.279: U2.2 7.75,24
USB5V  (via drill 0.33 pad 0.84, 0.5 pad 1.01)
  Top 0.254: LED2.A 12,14.8 11.8,15 10.8,15 10.5,15.3 LED3.A | v9,24 8.25,24 | 5.75,17.62 5.5,17.38 5.25,17.38 5,17.12 v5,16
  Top 0.279: 8.25,24 U2.1 | U2.19 5.75,17.62
  Top 0.406: LED2.A 12,13.25 | 12,13.25 12,14 v19.62,14 19.68,14 C4.1 19.68,9.32 C2.A | LED1.A 12,13.25 | U100.4 32.76,18.04 v33.02,17.78 | 19.65,7.35 F1.2
  Top 1.016: C2.A 19.65,7.35
  Bottom 0.254: v5,16 5,25.32 5.43,25.75 8.75,25.75 9,25.5 v9,24
  Bottom 0.406: v33.02,17.78 32.98,17.78 31,15.8 31,15 30,14 v19.62,14 6,14 5,15 v5,16
USB_N
  Top 0.254: U2.15 2.07,19.5 1.85,19.28 1.85,10.97 2.91,9.91 3.47,9.35 13.85,9.35 16,7.2 16,4.38 15.44,3.81 13.97,3.81 13.48,4.29 J1.D-
USB_P
  Top 0.254: J1.D+ 14.13,7.89 13.12,8.9 8.55,8.9 8.52,8.89 8.48,8.89 8.45,8.88 8.42,8.87 8.38,8.86 8.35,8.84 8.32,8.82 8.3,8.8 8.27,8.77 8.25,8.74 8.23,8.72 8.21,8.69 8.2,8.65 8.19,8.62 8.18,8.59 8.18,8.55 8.17,8.52 8.17,7.58 8.17,7.54 8.17,7.51 8.16,7.47 8.15,7.44 8.13,7.41 8.12,7.38 8.1,7.35 8.07,7.32 8.05,7.3 8.02,7.28 7.99,7.25 7.96,7.24 7.93,7.22 7.9,7.21 7.86,7.21 7.83,7.2 7.79,7.2 7.29,7.2 7.25,7.2 7.22,7.21 7.19,7.21 7.15,7.22 7.12,7.24 7.09,7.25 7.06,7.28 7.03,7.3 7.01,7.32 6.99,7.35 6.97,7.38 6.95,7.41 6.93,7.44 6.92,7.47 6.92,7.51 6.91,7.54 6.91,7.58 6.91,8.52 6.91,8.55 6.9,8.59 6.89,8.62 6.88,8.65 6.87,8.69 6.85,8.72 6.83,8.74 6.81,8.77 6.79,8.8 6.76,8.82 6.73,8.84 6.7,8.86 6.67,8.87 6.63,8.88 6.6,8.89 6.56,8.89 6.53,8.9 6.03,8.9 5.99,8.89 5.96,8.89 5.92,8.88 5.89,8.87 5.86,8.86 5.83,8.84 5.8,8.82 5.77,8.8 5.74,8.77 5.72,8.74 5.7,8.72 5.68,8.69 5.67,8.65 5.66,8.62 5.65,8.59 5.65,8.55 5.64,8.52 5.64,7.58 5.64,7.54 5.64,7.51 5.63,7.47 5.62,7.44 5.61,7.41 5.59,7.38 5.57,7.35 5.54,7.32 5.52,7.3 5.49,7.28 5.46,7.25 5.43,7.24 5.4,7.22 5.37,7.21 5.33,7.21 5.3,7.2 5.26,7.2 4.76,7.2 4.73,7.2 4.69,7.21 4.66,7.21 4.62,7.22 4.59,7.24 4.56,7.25 4.53,7.28 4.5,7.3 4.48,7.32 4.46,7.35 4.44,7.38 4.42,7.41 4.41,7.44 4.4,7.47 4.39,7.51 4.38,7.54 4.38,7.58 4.38,8.52 4.38,8.55 4.38,8.59 4.37,8.62 4.36,8.65 4.34,8.69 4.32,8.72 4.3,8.74 4.28,8.77 4.26,8.8 4.23,8.82 4.2,8.84 4.17,8.86 4.14,8.87 4.1,8.88 4.07,8.89 4.04,8.89 4,8.9 3.28,8.9 2.59,9.59 1.4,10.78 1.4,19.47 1.93,20 U2.14
VCC  (via drill 0.33 pad 0.84, 0.6 pad 1.11)
  Top 0.254: J2.12 26.68,22.72 26.68,22.96 25.71,23.92 23.92,23.92 v22.25,22.25 RN2.1 | 12.76,35.41 12.85,35.5 12.85,35.05 13.4,34.5 14.98,34.5 15.18,34.5 15.46,34.5 15.62,34.34 15.74,34.22 16.07,34.22 v16.73,34.22 | 12.76,35.41 12.6,35.25 R4.1 R5.1 10.4,35.2 R2.1 | 12.66,35.41 12.76,35.41 | U3.18 | R101.2 30.08,31.08 30.1,31.06 30.79,30.38 32.21,30.38 32.79,30.96 32.79,31.11 32.79,32.94 33.38,33.53 34.59,33.53 35,33.93 D1.C
  Top 0.305: R101.2 v26.55,34.15 | 39.05,7.97 39.05,8.54 C101.1 | C8.1 | v13.64,22.25 13.64,23.8 C8.1 | U3.4 15.22,24.02 15.24,24 | 15.24,24 16.06,24 16.24,24.17 U3.6 | C8.1 15.24,24 | 16.72,31.97 16.72,31.75 | 16.72,31.75 U3.18 | 16.72,34.2 v16.73,34.22 C13.1 16.72,31.75
  Top 0.406: J2.16 26.6,17.64 26.6,16.61 U1.3 22.16,15.4 C1.1
  Top 0.46: U101.7 39.05,7.97
  Top 0.61: C101.1 38.8,8.8 38.8,10.55 v38.55,10.8
  Bottom 0.305: 17.75,22.28 17.75,22.25 v13.64,22.25 | 17.75,22.28 17.78,22.25 | 17.78,22.25 17.5,22.25 | v22.25,22.25 17.78,22.25 | 21.57,31.73 20.9,32.39 19.07,34.22 | 21.57,31.73 23.42,29.87 24.13,29.21 24.28,29.06 25.88,29.06 26.09,29.06 26.49,29.46 26.55,29.52 v26.55,34.15 | 17.75,22.28 18.8,22.28 18.8,28.7 18.8,28.96 21.57,31.73 | v16.73,34.22 19.07,34.22 | 18.8,34.22 19.07,34.22
  Bottom 0.406: J2.12 27.92,22.82 27.95,22.82
  Bottom 0.61: v38.55,10.8 38.55,21.41 35.02,24.94 30.07,24.94 27.95,22.82 | J2.12 J2.14 J2.16

### Text on the board
tPlace: 3216 Bluetooth Controller | RESET | CHARGE | TX | RX | OFF | Rev. 125 | ON | PWR